# Altium schematic sheet Cover.SchDoc
size A3; ApprovedBy: UDEMY; CheckedBy: Öğrenciler; Revision: AA; SheetNumber: 1; SheetTotal: 5; PageSize: A3; Change Date: 15/09/2023; Rel Date: 15/09/2023; Department: R&D-Hardware; Prepared By: Ali ALCAN; ProjectDescription: Wireless Security Detector
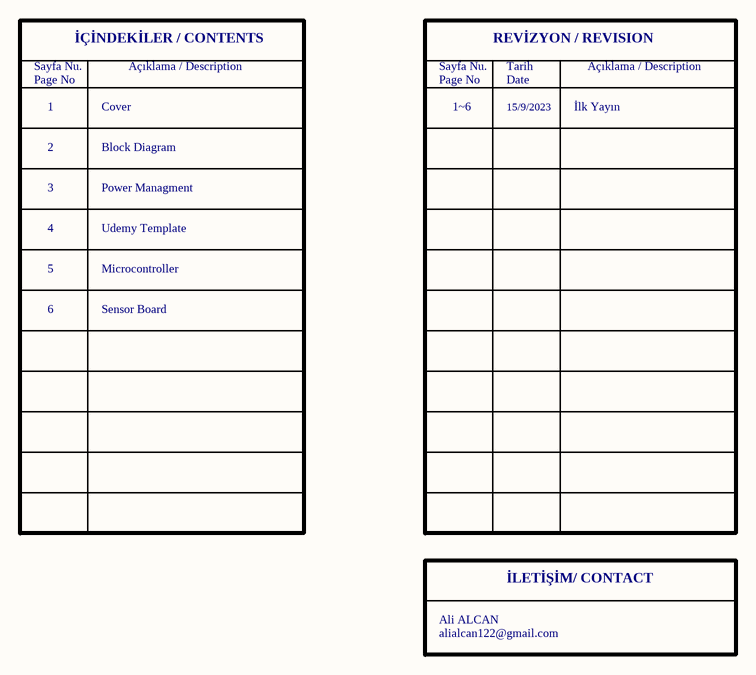
[diagram p0: Cover.SchDoc]

## Notes on the sheet
- İÇİNDEKİLER / CONTENTS
- REVİZYON / REVISION
- Sayfa Nu.
- Page No
- 1
- Cover
- Açıklama / Description
- 1~6
- Tarih
- Date
- 15/9/2023
- İlk Yayın
- 2
- Block Diagram
- 3
- 4
- Power Managment
- Udemy Template
- 5
- 6
- Sensor Board
- Microcontroller
- İLETİŞİM/ CONTACT
- Ali ALCAN
- alialcan122@gmail.com
- Dosya Adı / File Name
- Hazırlayan / Prepared By
- Tanım / Description
- Değiştirme Tarihi / Changed Date
- Bölüm / Department
- Onaylayan / Approved By
- Kontrol Eden / Checked By
- Boyut / Size
- Sayfa / Sheet
- Revizyon / Revision